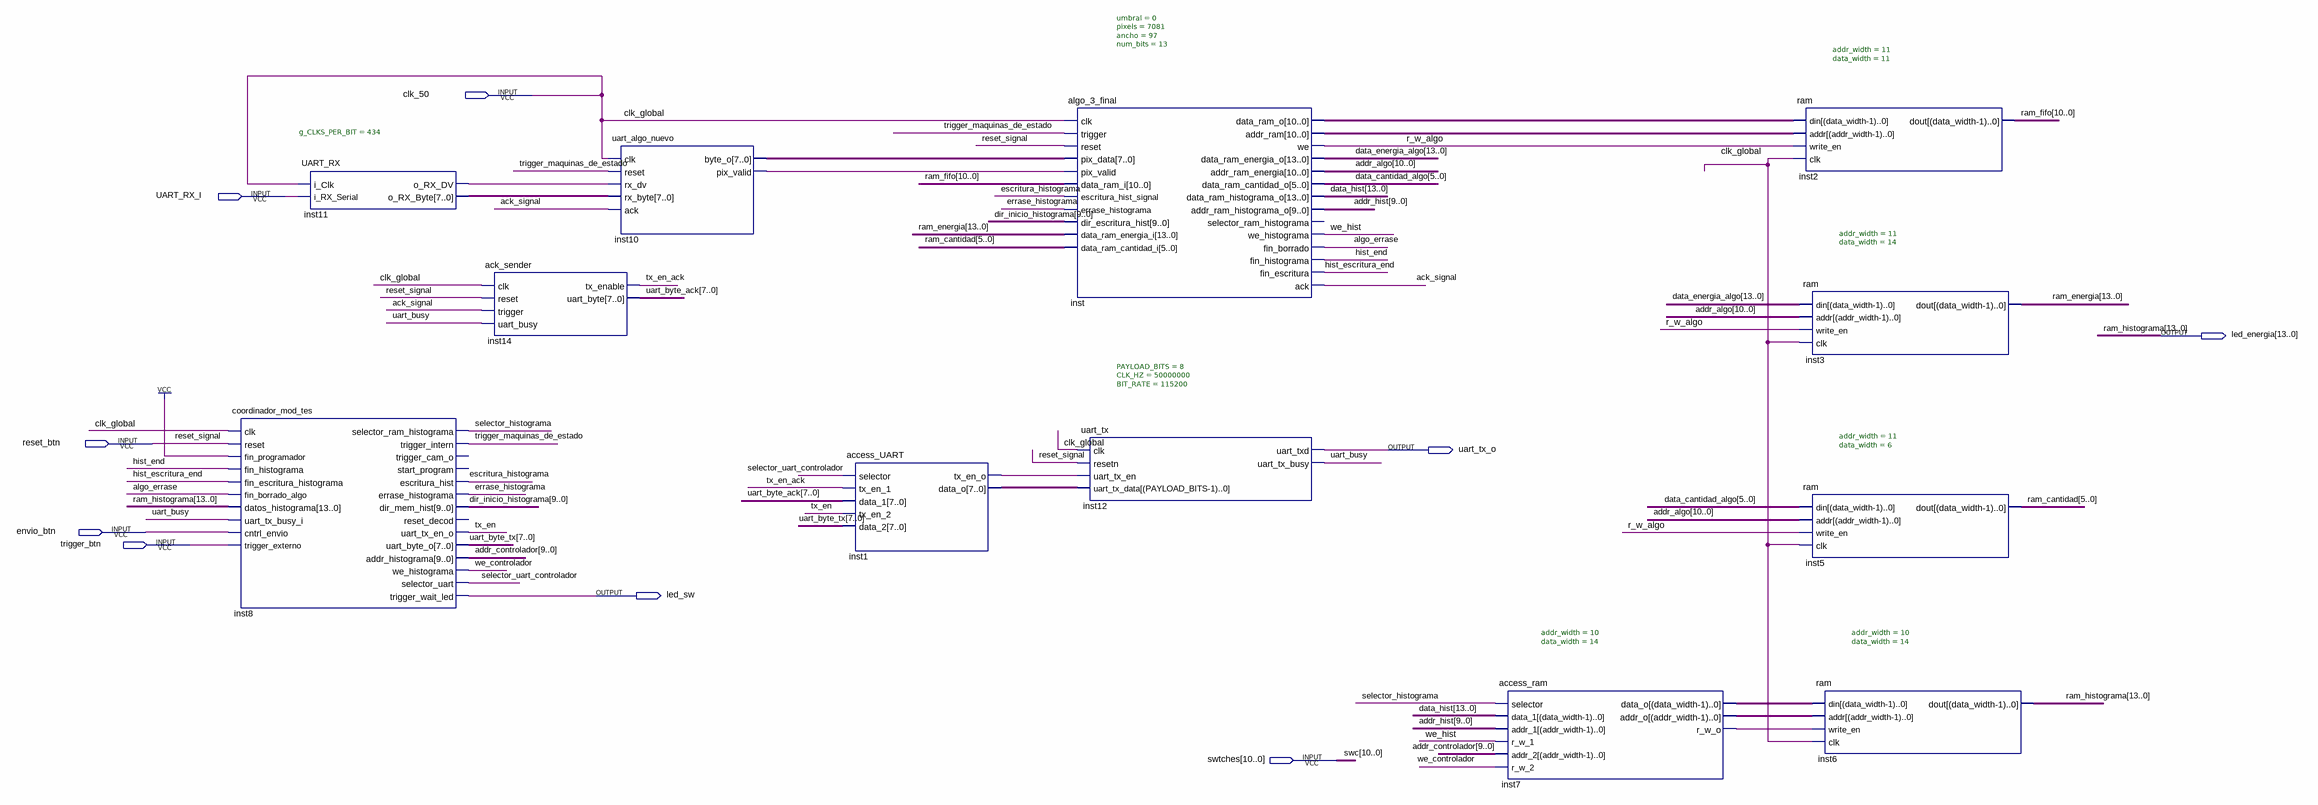
[diagram p0: schematic sheet]
// Quartus schematic test_sistema_completo_uart_2.bdf as structural Verilog: 12 symbols, 9 pins
module test_sistema_completo_uart_2 (
  input  clk_50,
  input  UART_RX_I,
  input  reset_btn,
  input  envio_btn,
  input  trigger_btn,
  input  [10:0] swtches,
  output [13:0] led_energia,
  output uart_tx_o,
  output led_sw
);

  wire ack_signal, algo_errase, errase_histograma, escritura_histograma, hist_end, hist_escritura_end,
       inst1_tx_en_o, inst7_r_w_o, inst10_pix_valid, inst11_o_rx_dv, r_w_algo, selector_histograma,
       selector_uart_controlador, trigger_maquinas_de_estado, tx_en, tx_en_ack, uart_busy, we_controlador,
       we_hist;
  wire [5:0] data_cantidad_algo, ram_cantidad;
  wire [7:0] inst1_data_o, inst10_byte_o, inst11_o_rx_byte, uart_byte_ack, uart_byte_tx;
  wire [9:0] addr_controlador, addr_hist, dir_inicio_histograma, inst7_addr_o;
  wire [10:0] addr_algo, inst_addr_ram, inst_data_ram_o, ram_fifo;
  wire [13:0] data_energia_algo, data_hist, inst7_data_o, ram_energia;

  coordinador_mod_tes inst8 (
    .clk(clk_50), .reset(reset_btn), .fin_programador(1'b1), .fin_histograma(hist_end),
    .fin_escritura_histograma(hist_escritura_end), .fin_borrado_algo(algo_errase),
    .datos_histograma(led_energia), .uart_tx_busy_i(uart_busy), .cntrl_envio(envio_btn),
    .trigger_externo(trigger_btn), .selector_ram_histograma(selector_histograma),
    .trigger_intern(trigger_maquinas_de_estado), .escritura_hist(escritura_histograma),
    .errase_histograma(errase_histograma), .dir_mem_hist(dir_inicio_histograma), .uart_tx_en_o(tx_en),
    .uart_byte_o(uart_byte_tx), .addr_histograma(addr_controlador), .we_histograma(we_controlador),
    .selector_uart(selector_uart_controlador), .trigger_wait_led(led_sw));  // open: trigger_cam_o, start_program, reset_decod
  UART_RX #(.g_CLKS_PER_BIT(434)) inst11 (
    .i_Clk(clk_50), .i_RX_Serial(UART_RX_I), .o_RX_DV(inst11_o_rx_dv), .o_RX_Byte(inst11_o_rx_byte));
  ack_sender inst14 (
    .clk(clk_50), .reset(reset_btn), .trigger(ack_signal), .uart_busy(uart_busy), .tx_enable(tx_en_ack),
    .uart_byte(uart_byte_ack));
  uart_algo_nuevo inst10 (
    .clk(clk_50), .reset(trigger_maquinas_de_estado), .rx_dv(inst11_o_rx_dv), .rx_byte(inst11_o_rx_byte),
    .ack(ack_signal), .byte_o(inst10_byte_o), .pix_valid(inst10_pix_valid));
  access_UART inst1 (
    .selector(selector_uart_controlador), .tx_en_1(tx_en_ack), .data_1(uart_byte_ack), .tx_en_2(tx_en),
    .data_2(uart_byte_tx), .tx_en_o(inst1_tx_en_o), .data_o(inst1_data_o));
  algo_3_final #(.umbral(0), .pixels(7081), .ancho(97), .num_bits(13)) inst (
    .clk(clk_50), .trigger(trigger_maquinas_de_estado), .reset(reset_btn), .pix_data(inst10_byte_o),
    .pix_valid(inst10_pix_valid), .data_ram_i(ram_fifo), .escritura_hist_signal(escritura_histograma),
    .errase_histograma(errase_histograma), .dir_escritura_hist(dir_inicio_histograma),
    .data_ram_energia_i(ram_energia), .data_ram_cantidad_i(ram_cantidad), .data_ram_o(inst_data_ram_o),
    .addr_ram(inst_addr_ram), .we(r_w_algo), .data_ram_energia_o(data_energia_algo),
    .addr_ram_energia(addr_algo), .data_ram_cantidad_o(data_cantidad_algo),
    .data_ram_histograma_o(data_hist), .addr_ram_histograma_o(addr_hist), .we_histograma(we_hist),
    .fin_borrado(algo_errase), .fin_histograma(hist_end), .fin_escritura(hist_escritura_end), .ack(ack_signal));  // open: selector_ram_histograma
  uart_tx #(.PAYLOAD_BITS(8), .CLK_HZ(50000000), .BIT_RATE(115200)) inst12 (
    .clk(clk_50), .resetn(reset_btn), .uart_tx_en(inst1_tx_en_o), .uart_tx_data(inst1_data_o),
    .uart_txd(uart_tx_o), .uart_tx_busy(uart_busy));
  access_ram #(.addr_width(10), .data_width(14)) inst7 (
    .selector(selector_histograma), .data_1(data_hist), .addr_1(addr_hist), .r_w_1(we_hist),
    .addr_2(addr_controlador), .r_w_2(we_controlador), .data_o(inst7_data_o), .addr_o(inst7_addr_o),
    .r_w_o(inst7_r_w_o));
  ram #(.addr_width(11), .data_width(11)) inst2 (
    .din(inst_data_ram_o), .addr(inst_addr_ram), .write_en(r_w_algo), .clk(clk_50), .dout(ram_fifo));
  ram #(.addr_width(11), .data_width(14)) inst3 (
    .din(data_energia_algo), .addr(addr_algo), .write_en(r_w_algo), .clk(clk_50), .dout(ram_energia));
  ram #(.addr_width(11), .data_width(6)) inst5 (
    .din(data_cantidad_algo), .addr(addr_algo), .write_en(r_w_algo), .clk(clk_50), .dout(ram_cantidad));
  ram #(.addr_width(10), .data_width(14)) inst6 (
    .din(inst7_data_o), .addr(inst7_addr_o), .write_en(inst7_r_w_o), .clk(clk_50), .dout(led_energia));

  // Other names for the same wires on the sheet: clk_global = clk_50; ram_histograma[13:0] = led_energia;
  //   reset_signal = reset_btn; swc[10:0] = swtches
endmodule
